# Altium schematic sheet FPGA_MGT.SchDoc
size A4; SheetNumber: 10; SheetTotal: 14
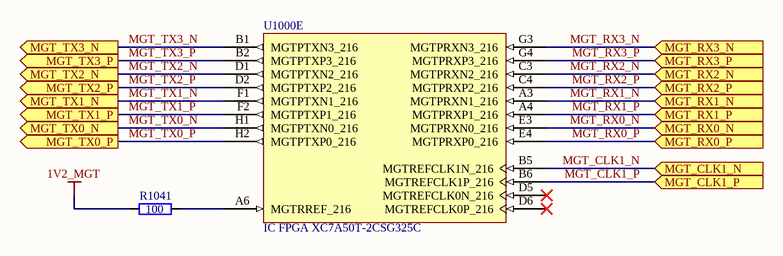
[diagram p0: FPGA_MGT.SchDoc]

## Parts
R1041  100  [GEN_R_0402]
U1000  IC FPGA XC7A50T-2CSG325C  [XILINX_XC7A50T-2CSG325C]  (part E of 9)

## Ports
MGT_CLK1_N (in), MGT_CLK1_P (in), MGT_RX0_N (in), MGT_RX0_P (in), MGT_RX1_N (in), MGT_RX1_P (in), MGT_RX2_N (in), MGT_RX2_P (in), MGT_RX3_N (in), MGT_RX3_P (in), MGT_TX0_N (out), MGT_TX0_P (out), MGT_TX1_N (out), MGT_TX1_P (out), MGT_TX2_N (out), MGT_TX2_P (out), MGT_TX3_N (out), MGT_TX3_P (out)

## Nets
1V2_MGT: R1041.1
MGT_CLK1_N: U1000.B5(MGTREFCLK1N_216) ; port MGT_CLK1_N
MGT_CLK1_P: U1000.B6(MGTREFCLK1P_216) ; port MGT_CLK1_P
MGT_RX0_N: U1000.E3(MGTPRXN0_216) ; port MGT_RX0_N
MGT_RX0_P: U1000.E4(MGTPRXP0_216) ; port MGT_RX0_P
MGT_RX1_N: U1000.A3(MGTPRXN1_216) ; port MGT_RX1_N
MGT_RX1_P: U1000.A4(MGTPRXP1_216) ; port MGT_RX1_P
MGT_RX2_N: U1000.C3(MGTPRXN2_216) ; port MGT_RX2_N
MGT_RX2_P: U1000.C4(MGTPRXP2_216) ; port MGT_RX2_P
MGT_RX3_N: U1000.G3(MGTPRXN3_216) ; port MGT_RX3_N
MGT_RX3_P: U1000.G4(MGTPRXP3_216) ; port MGT_RX3_P
MGT_TX0_N: U1000.H1(MGTPTXN0_216) ; port MGT_TX0_N
MGT_TX0_P: U1000.H2(MGTPTXP0_216) ; port MGT_TX0_P
MGT_TX1_N: U1000.F1(MGTPTXN1_216) ; port MGT_TX1_N
MGT_TX1_P: U1000.F2(MGTPTXP1_216) ; port MGT_TX1_P
MGT_TX2_N: U1000.D1(MGTPTXN2_216) ; port MGT_TX2_N
MGT_TX2_P: U1000.D2(MGTPTXP2_216) ; port MGT_TX2_P
MGT_TX3_N: U1000.B1(MGTPTXN3_216) ; port MGT_TX3_N
MGT_TX3_P: U1000.B2(MGTPTXP3_216) ; port MGT_TX3_P
NetR1041_2: R1041.2 U1000.A6(MGTRREF_216)

Not connected (* = marked no-connect by the designer): U1000 D5(MGTREFCLK0N_216)* D6(MGTREFCLK0P_216)*

## Library data of the parts
R1041 = RES 100 OHM 1% 1/10W 0402: Manufacturer: Yageo; Manufacturer Part Number: RC0402FR-07100RL; Tolerance: 1%; Package: 0402; Value: 100; Supplier 1: Mouser; Supplier Part Number 1: 603-RC0402FR-07100RL
U1000 = IC FPGA XC7A50T-2CSG325C: Artix-7 FPGA, 150 User I/Os, 4 GTP, 324-Ball BGA, Speed Grade 2, Commercial Grade, Pb-Free; Manufacturer: Xilinx; House Part Number: XC7A50T-2CSG325C; Manufacturer Part Number: XC7A50T-2CSG325C; Supplier 1: Digi-Key; Supplier Part Number 1: 122-2193-ND